# Altium project Channel One.PrjPcb
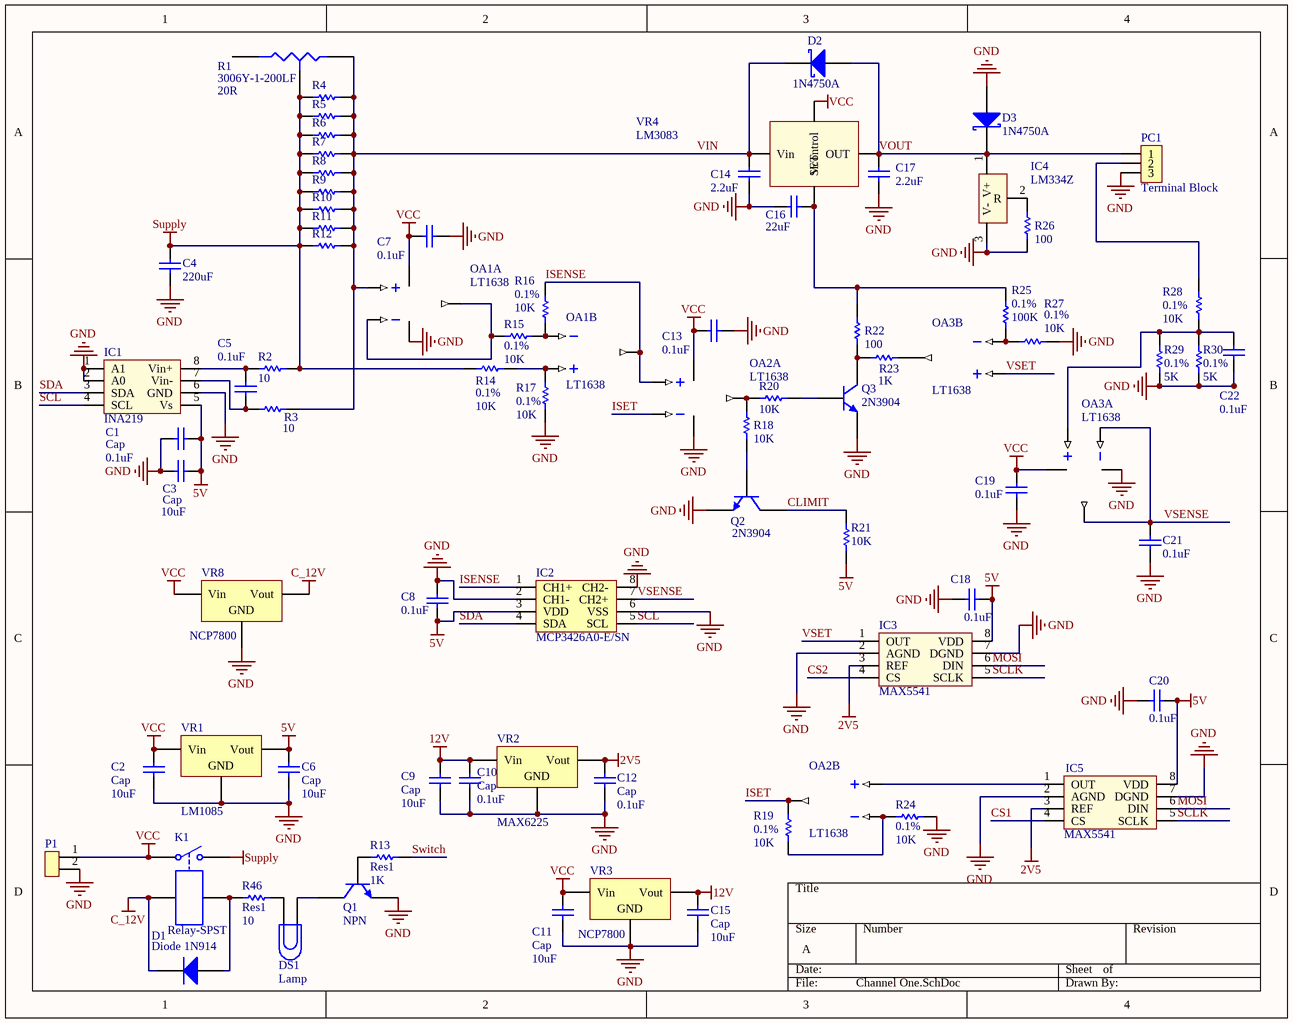
[diagram p0: Channel One.SchDoc]
3 sheets, 130 parts. Net scope: global (net labels, ports and power ports of the same name join across sheets).
Board file: Channel One.PcbDoc
Sheets:
  Channel One.SchDoc
  Logic.SchDoc
  Connector.SchDoc

## Sheet Channel One.SchDoc
size A

### Parts
C1  Cap  value 0.1uF  [RAD-0.1]
C2  Cap  value 10uF  [RAD-0.2]
C3  Cap  value 10uF  [RAD-0.2]
C4  value 220uF  [RAD-0.2]  (hidden comment: Cap)
C5  value 0.1uF  [RAD-0.1]  (hidden comment: Cap)
C6  Cap  value 10uF  [RAD-0.2]
C7  value 0.1uF  [RAD-0.1]  (hidden comment: Cap)
C8  value 0.1uF  [RAD-0.1]  (hidden comment: Cap)
C9  Cap  value 10uF  [RAD-0.2]
C10  Cap  value 0.1uF  [RAD-0.1]
C11  Cap  value 10uF  [RAD-0.2]
C12  Cap  value 0.1uF  [RAD-0.1]
C13  value 0.1uF  [RAD-0.1]  (hidden comment: Cap)
C14  value 2.2uF  [RAD-0.1]  (hidden comment: Cap)
C15  Cap  value 10uF  [RAD-0.2]
C16  value 22uF  [RAD-0.2]  (hidden comment: Cap)
C17  value 2.2uF  [RAD-0.2]  (hidden comment: Cap)
C18  value 0.1uF  [RAD-0.1]  (hidden comment: Cap)
C19  value 0.1uF  [RAD-0.1]  (hidden comment: Cap)
C20  value 0.1uF  [RAD-0.1]  (hidden comment: Cap)
C21  value 0.1uF  [RAD-0.1]  (hidden comment: Cap)
C22  value 0.1uF  [RAD-0.1]  (hidden comment: Cap)
D1  Diode 1N914  [DO-35]
D2  1N4750A  [DO-35]
D3  1N4750A  [DO-35]
DS1  Lamp  [PIN2]
IC1  INA219  [8-SO]
IC2  MCP3426A0-E/SN  [8-SO]
IC3  MAX5541  [8-SO]
IC4  LM334Z  [LM134]
IC5  MAX5541  [8-SO]
K1  Relay-SPST  [MODULE4]
OA1  LT1638  [8-DIP]  (parts A,B of 2)
OA2  LT1638  [8-DIP]  (parts A,B of 2)
OA3  LT1638  [8-DIP]  (parts A,B of 2)
P1  Power Connector  [Power Connector]  (value not drawn)
PC1  Terminal Block  [Terminal Block 3]
Q1  NPN  [TO-226-AA]
Q2  2N3904  [TO-226-AA]
Q3  2N3904  [TO-226-AA]
R1  3006Y-1-200LF  value 20R  [VR3]
R2  value 10  [AXIAL-0.3]  (hidden comment: Res1)
R3  value 10  [AXIAL-0.3]  (hidden comment: Res1)
R4  Shunt  [AXIAL-0.3]  (value not drawn)
R5  Shunt  [AXIAL-0.3]  (value not drawn)
R6  Shunt  [AXIAL-0.3]  (value not drawn)
R7  Shunt  [AXIAL-0.3]  (value not drawn)
R8  Shunt  [AXIAL-0.3]  (value not drawn)
R9  Shunt  [AXIAL-0.3]  (value not drawn)
R10  Shunt  [AXIAL-0.3]  (value not drawn)
R11  Shunt  [AXIAL-0.3]  (value not drawn)
R12  Shunt  [AXIAL-0.3]  (value not drawn)
R13  Res1  value 1K  [AXIAL-0.3]
R14  0.1%  value 10K  [AXIAL-0.3]
R15  0.1%  value 10K  [AXIAL-0.3]
R16  0.1%  value 10K  [AXIAL-0.3]
R17  0.1%  value 10K  [AXIAL-0.3]
R18  value 10K  [AXIAL-0.3]  (hidden comment: Res)
R19  0.1%  value 10K  [AXIAL-0.3]
R20  value 10K  [AXIAL-0.3]  (hidden comment: Res)
R21  value 10K  [AXIAL-0.3]  (hidden comment: Res1)
R22  value 100  [AXIAL-0.3]  (hidden comment: Res)
R23  value 1K  [AXIAL-0.3]  (hidden comment: Res)
R24  0.1%  value 10K  [AXIAL-0.3]
R25  0.1%  value 100K  [AXIAL-0.3]
R26  value 100  [AXIAL-0.3]  (hidden comment: Res)
R27  0.1%  value 10K  [AXIAL-0.3]
R28  0.1%  value 10K  [AXIAL-0.3]
R29  0.1%  value 5K  [AXIAL-0.3]
R30  0.1%  value 5K  [AXIAL-0.3]
R46  Res1  value 10  [AXIAL-0.3]
VR1  LM1085  [TO220]
VR2  MAX6225  [8-DIP]
VR3  NCP7800  [TO220]
VR4  LM3083  [LT3083]
VR8  NCP7800  [TO220]

### Nets
2V5: C12.2 IC3.3(REF) IC5.3(REF) VR2.6(Vout)
5V: C1.2 C3.2 C6.2 C8.1 C18.2 C20.2 IC1.5(Vs) IC2.3(VDD) IC3.8(VDD) IC5.8(VDD) R21.1 VR1.3(Vout)
12V: C9.2 C10.2 C15.2 VR2.2(Vin) VR3.3(Vout)
C_12V: D1.2(K) K1.3 VR8.3(Vout)
GND: C1.1 C2.1 C3.1 C4.1 C6.1 C7.2 C8.2 C9.1 C10.1 C11.1 C12.1 C13.2 C14.1 C15.1 C16.2 C17.1 C18.1 C19.1 C20.1 C21.2 C22.2 D3.1(A) IC1.1(A1) IC1.2(A0) IC1.6(GND) IC2.2(CH1-) IC2.6(VSS) IC2.8(CH2-) IC3.2(AGND) IC3.7(DGND) IC4.3(V-) IC5.2(AGND) IC5.7(DGND) OA1.4(V-) OA2.4(V-) OA3.4(V-) P1.2 PC1.3 Q1.3(E) Q2.3(E) Q3.3(E) R17.1 R24.2 R26.2 R27.2 R29.1 R30.1 VR1.2(GND) VR2.4(GND) VR3.2(GND) VR8.2(GND)
Supply: C4.2 K1.2 R1.3(TAP) R2.1 R4.1 R5.1 R6.1 R7.1 R8.1 R9.1 R10.1 R11.1 R12.1 R14.1
VCC: C2.2 C7.1 C11.2 C13.1 C19.2 K1.1 OA1.8(V+) OA2.8(V+) OA3.8(V+) P1.1 VR1.1(Vin) VR3.1(Vin) VR4.4(Vcontrol) VR8.1(Vin)
CLIMIT: Q2.1(C) R21.2
CS1: IC5.4(CS)
CS2: IC3.4(CS)
ISENSE: IC2.1(CH1+) OA1.7(OUTB) OA2.3(+INA) R16.2
ISET: OA2.2(-INA) OA2.7(OUTB) R19.1
MOSI: IC3.6(DIN) IC5.6(DIN)
SCL: IC1.4(SCL) IC2.5(SCL)
SCLK: IC3.5(SCLK) IC5.5(SCLK)
SDA: IC1.3(SDA) IC2.4(SDA)
Switch: R13.1
VIN: C14.2 D2.2(K) OA1.3(+INA) R1.1(A) R3.2 R4.2 R5.2 R6.2 R7.2 R8.2 R9.2 R10.2 R11.2 R12.2 VR4.5(Vin)
VOUT: C17.2 D2.1(A) D3.2(K) IC4.1(V+) PC1.1 VR4.3(OUT)
VSENSE: C21.1 IC2.7(CH2+) OA3.1(OUTA) OA3.2(-INA)
VSET: IC3.1(OUT) OA3.5(+INB)
NetC5_1: C5.1 IC1.7(Vin-) R3.1
NetC5_2: C5.2 IC1.8(Vin+) R2.2
NetC16_1: C16.1 R22.1 R25.1 VR4.2(SET)
NetC22_1: C22.1 OA3.3(+INA) R28.1 R29.2 R30.2
NetD1_1: D1.1(A) K1.4 R46.2
NetDS1_1: DS1.1 Q1.1(C)
NetDS1_2: DS1.2 R46.1
NetIC4_2: IC4.2(R) R26.1
NetIC5_1: IC5.1(OUT) OA2.5(+INB)
NetOA1_1: OA1.1(OUTA) OA1.2(-INA) R15.1
NetOA1_5: OA1.5(+INB) R14.2 R17.2
NetOA1_6: OA1.6(-INB) R15.2 R16.1
NetOA2_1: OA2.1(OUTA) R18.1 R20.2
NetOA2_6: OA2.6(-INB) R19.2 R24.1
NetOA3_6: OA3.6(-INB) R25.2 R27.1
NetOA3_7: OA3.7(OUTB) R23.2
NetPC1_2: PC1.2 R28.2
NetQ1_2: Q1.2(B) R13.2
NetQ2_2: Q2.2(B) R18.2
NetQ3_1: Q3.1(C) R22.2 R23.1
NetQ3_2: Q3.2(B) R20.1

Not connected (* = marked no-connect by the designer): R1 2(B)

### Library data of the parts
C1-C22 = Cap: Capacitor; Published: 8-Jun-2000; LatestRevisionDate: 17-Jul-2002; LatestRevisionNote: Re-released for DXP Platform.; PackageReference: RAD-0.3; Publisher: Altium Limited; PackageDescription: Radial Cap, Thru-Hole; 2 Leads; 0.3 in Pin Spacing
D1 = Diode 1N914: High Conductance Fast Diode; Published: 8-Jun-2000; LatestRevisionDate: 17-Jul-2002; LatestRevisionNote: Re-released for DXP Platform.; DatasheetVersion: 1997; PackageReference: DO-35; Publisher: Altium Limited; PackageDescription: Diode, Axial; Body 3.8 x 1.9 mm (LxDia. max), Lead Dia. 0.53 mm (max); Code_JEDEC: DO-204-AH; ComponentLink1Description: Manufacturer Link; ComponentLink1URL: http://www.fairchildsemi.com/; ComponentLink2Description: Datasheet; ComponentLink2URL: http://www.fairchildsemi.com/ds/1N%2F1N4448.pdf
D2 D3 = D Schottky: Schottky Diode; Published: 8-Jun-2000; LatestRevisionDate: 17-Jul-2002; LatestRevisionNote: Re-released for DXP Platform.; PackageReference: SMB; Publisher: Altium Limited; PackageDescription: DO-214-AA/SMB; 2 C-Bend Leads; Body 5.3 x 3.6 mm, inc. leads (LxW); Code_JEDEC: DO-214-AA
DS1 = Lamp: Incandescent Bulb; Published: 24-Mar-1999; LatestRevisionDate: 17-Jul-2002; LatestRevisionNote: Re-released for DXP Platform.; PackageReference: PIN2; Publisher: Altium Limited
IC1 = Current Sense
IC2 = ADC
IC3 IC5 = DAC
IC4 = Constant Current
K1 = Relay-SPST: Single-Pole Single-Throw Relay; Published: 24-Mar-1999; LatestRevisionDate: 17-Jul-2002; LatestRevisionNote: Re-released for DXP Platform.; PackageReference: MODULE4; Publisher: Altium Limited
OA1-OA3 = Operational Amp
Q1-Q3 = NPN: NPN Bipolar Transistor; Published: 8-Jun-2000; LatestRevisionDate: 17-Jul-2002; LatestRevisionNote: Re-released for DXP Platform.; PackageReference: TO-226-AA; Publisher: Altium Limited; PackageDescription: TO, Flat Index; 3 In-Line, Axial Leads; Body Dia. 4.8mm; Leads 0.55 x 0.51 mm (max); Code_JEDEC: TO-226-AA
R1 = Res Tap: Tapped Resistor; Sim Note: Enter the Resistance value and the set point into parameter fields.; Set Position: 0.5; Published: 24-Mar-1999; LatestRevisionDate: 17-Jul-2002; LatestRevisionNote: Re-released for DXP Platform.; PackageReference: VR3; Publisher: Altium Limited; PackageDescription: Variable Resistor, Thru-Hole; 3 Leads
R2 R3 R13-R30 R46 = Res1: Resistor; Published: 8-Jun-2000; LatestRevisionDate: 17-Jul-2002; LatestRevisionNote: Re-released for DXP Platform.; PackageReference: AXIAL-0.3; Publisher: Altium Limited; PackageDescription: Axial Device, Thru-Hole; 2 Leads; 0.3 in Pin Spacing
R4-R12 = Res1: Resistor; Value: 10; Published: 8-Jun-2000; LatestRevisionDate: 17-Jul-2002; LatestRevisionNote: Re-released for DXP Platform.; PackageReference: AXIAL-0.3; Publisher: Altium Limited; PackageDescription: Axial Device, Thru-Hole; 2 Leads; 0.3 in Pin Spacing
VR1 = Voltage Regulator 5V
VR2 = Voltage Reference 2.5V
VR3 VR8 = Voltage Regulator 12V
VR4 = Adjustable Regulator

## Sheet Logic.SchDoc
size A
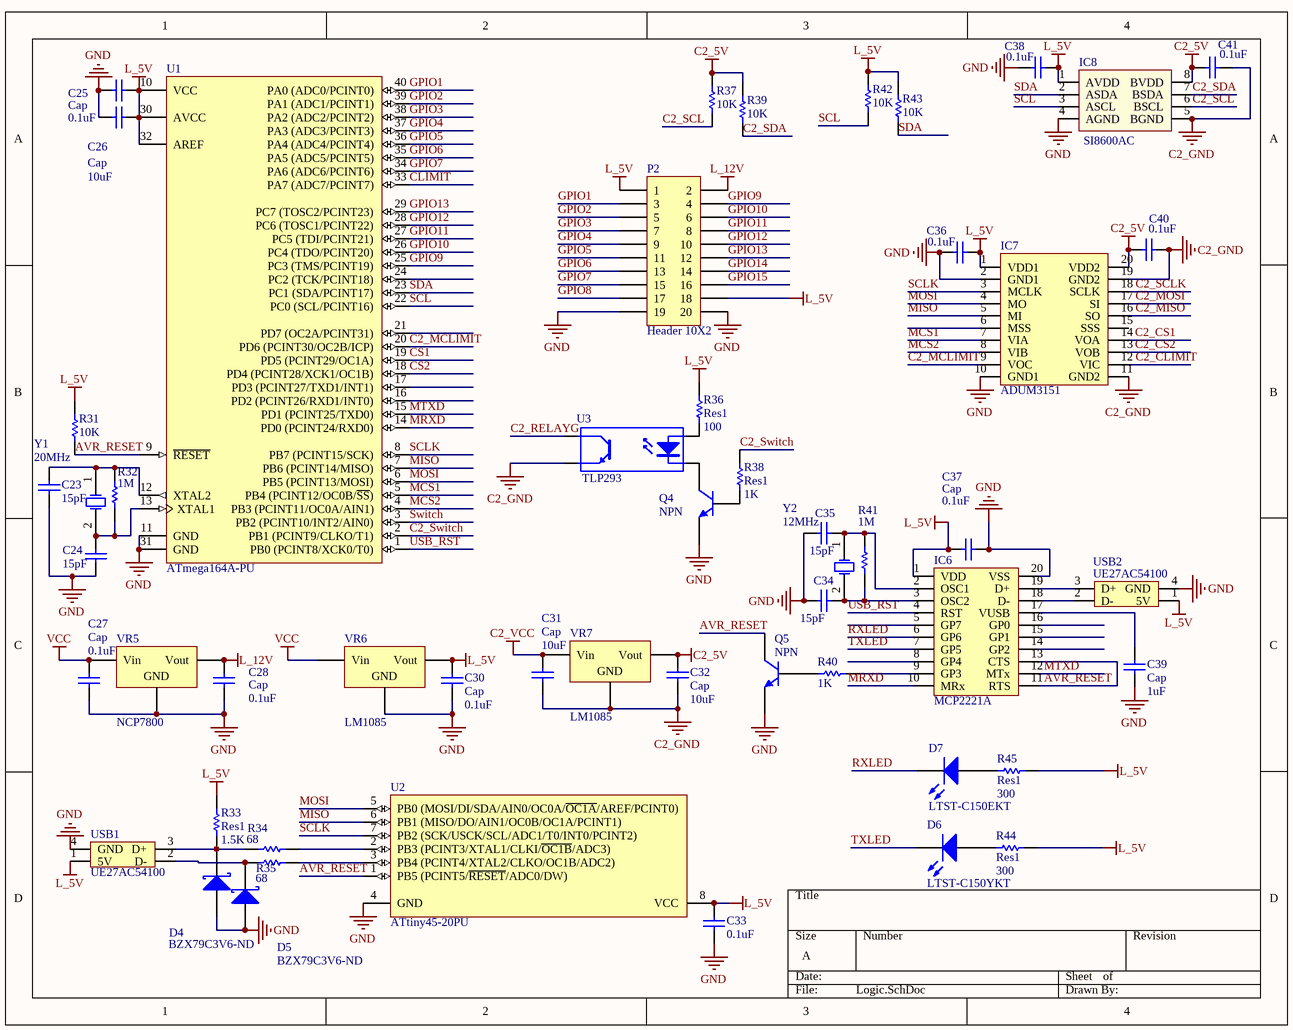
[diagram p1: Logic.SchDoc]

### Parts
C23  value 15pF  [RAD-0.1]  (hidden comment: Cap)
C24  value 15pF  [RAD-0.1]  (hidden comment: Cap)
C25  Cap  value 0.1uF  [RAD-0.1]
C26  Cap  value 10uF  [RAD-0.2]
C27  Cap  value 0.1uF  [RAD-0.1]
C28  Cap  value 0.1uF  [RAD-0.1]
C30  Cap  value 0.1uF  [RAD-0.1]
C31  Cap  value 10uF  [RAD-0.1]
C32  Cap  value 10uF  [RAD-0.1]
C33  value 0.1uF  [RAD-0.1]  (hidden comment: Cap)
C34  value 15pF  [RAD-0.1]  (hidden comment: Cap)
C35  value 15pF  [RAD-0.1]  (hidden comment: Cap)
C36  value 0.1uF  [RAD-0.1]  (hidden comment: Cap)
C37  Cap  value 0.1uF  [RAD-0.1]
C38  value 0.1uF  [RAD-0.1]  (hidden comment: Cap)
C39  Cap  value 1uF  [RAD-0.1]
C40  value 0.1uF  [RAD-0.1]  (hidden comment: Cap)
C41  value 0.1uF  [RAD-0.1]  (hidden comment: Cap)
D4  BZX79C3V6-ND  [DO-35]
D5  BZX79C3V6-ND  [DO-35]
D6  LTST-C150YKT  [3.2X1.6X1.1]
D7  LTST-C150EKT  [3.2X1.6X1.1]
IC6  MCP2221A  [20-SO]
IC7  ADUM3151  [20-SSOP]
IC8  SI8600AC  [8-SO]
P2  Header 10X2  [HDR2X10]
Q4  NPN  [TO-226-AA]
Q5  NPN  [TO-226-AA]
R31  value 10K  [AXIAL-0.3]  (hidden comment: Res1)
R32  value 1M  [AXIAL-0.3]  (hidden comment: Res1)
R33  Res1  value 1.5K  [AXIAL-0.3]
R34  value 68  [AXIAL-0.3]  (hidden comment: Res1)
R35  value 68  [AXIAL-0.3]  (hidden comment: Res1)
R36  Res1  value 100  [AXIAL-0.3]
R37  value 10K  [AXIAL-0.3]  (hidden comment: Res1)
R38  Res1  value 1K  [AXIAL-0.3]
R39  value 10K  [AXIAL-0.3]  (hidden comment: Res1)
R40  value 1K  [AXIAL-0.3]  (hidden comment: Res1)
R41  value 1M  [AXIAL-0.3]  (hidden comment: Res1)
R42  value 10K  [AXIAL-0.3]  (hidden comment: Res1)
R43  value 10K  [AXIAL-0.3]  (hidden comment: Res1)
R44  Res1  value 300  [AXIAL-0.3]
R45  Res1  value 300  [AXIAL-0.3]
U1  ATmega164A-PU  [40P6]
U2  ATtiny45-20PU  [8P3]
U3  TLP293  [2-SO]
USB1  UE27AC54100  [USB]
USB2  UE27AC54100  [USB]
VR5  NCP7800  [TO220]
VR6  LM1085  [TO220]
VR7  LM1085  [TO220]
Y1  20MHz  [R38]
Y2  12MHz  [R38]

### Nets
C2_5V: C32.2 C40.2 C41.1 IC7.20(VDD2) IC8.8(BVDD) R37.2 R39.2 VR7.3(Vout)
C2_GND: C31.1 C32.1 C40.1 C41.2 IC7.11(GND2) IC7.19(GND2) IC8.5(BGND) U3.3(E) VR7.2(GND)
C2_VCC: C31.2 VR7.1(Vin)
GND: C23.2 C24.2 C25.1 C26.1 C27.1 C28.1 C30.1 C33.1 C34.1 C35.1 C36.1 C37.2 C38.1 C39.1 D4.1(A) D5.1(A) IC6.20(VSS) IC7.2(GND1) IC7.10(GND1) IC8.4(AGND) P2.19 P2.20 Q4.3(E) Q5.3(E) U1.11(GND) U1.31(GND) U2.4(GND) USB1.4(GND) USB2.4(GND) VR5.2(GND) VR6.2(GND)
L_5V: C25.2 C26.2 C30.2 C33.2 C36.2 C37.1 C38.2 IC6.1(VDD) IC7.1(VDD1) IC8.1(AVDD) P2.1 P2.18 R31.2 R33.1 R36.2 R42.2 R43.2 R44.2 R45.2 U1.10(VCC) U1.30(AVCC) U1.32(AREF) U2.8(VCC) USB1.1(5V) USB2.1(5V) VR6.3(Vout)
L_12V: C28.2 P2.2 VR5.3(Vout)
VCC: C27.2 VR5.1(Vin) VR6.1(Vin)
AVR_RESET: IC6.11(RTS) IC6.13(CTS) Q5.1(C) R31.1 U1.9(~{RESET}) U2.1(PB5_(PCINT5/~{RESET}/ADC0/DW))
C2_CLIMIT: IC7.12(VIC)
C2_CS1: IC7.14(VOA)
C2_CS2: IC7.13(VOB)
C2_MCLIMIT: IC7.9(VOC) U1.20(PD6_(PCINT30/OC2B/ICP))
C2_MISO: IC7.16(SO)
C2_MOSI: IC7.17(SI)
C2_RELAYG: U3.4(C)
C2_SCL: IC8.6(BSCL) R37.1
C2_SCLK: IC7.18(SCLK)
C2_SDA: IC8.7(BSDA) R39.1
C2_Switch: R38.1 U1.2(PB1_(PCINT9/CLKO/T1))
CLIMIT: U1.33(PA7_(ADC7/PCINT7))
CS1: U1.19(PD5_(PCINT29/OC1A))
CS2: U1.18(PD4_(PCINT28/XCK1/OC1B))
GPIO1: P2.3 U1.40(PA0_(ADC0/PCINT0))
GPIO2: P2.5 U1.39(PA1_(ADC1/PCINT1))
GPIO3: P2.7 U1.38(PA2_(ADC2/PCINT2))
GPIO4: P2.9 U1.37(PA3_(ADC3/PCINT3))
GPIO5: P2.11 U1.36(PA4_(ADC4/PCINT4))
GPIO6: P2.13 U1.35(PA5_(ADC5/PCINT5))
GPIO7: P2.15 U1.34(PA6_(ADC6/PCINT6))
GPIO8: P2.17
GPIO9: P2.4 U1.25(PC3_(TMS/PCINT19))
GPIO10: P2.6 U1.26(PC4_(TDO/PCINT20))
GPIO11: P2.8 U1.27(PC5_(TDI/PCINT21))
GPIO12: P2.10 U1.28(PC6_(TOSC1/PCINT22))
GPIO13: P2.12 U1.29(PC7_(TOSC2/PCINT23))
GPIO14: P2.14
GPIO15: P2.16
MCS1: IC7.7(VIA) U1.5(PB4_(PCINT12/OC0B/~{SS}))
MCS2: IC7.8(VIB) U1.4(PB3_(PCINT11/OC0A/AIN1))
MISO: IC7.5(MI) U1.7(PB6_(PCINT14/MISO)) U2.6(PB1_(MISO/DO/AIN1/OC0B/OC1A/PCINT1))
MOSI: IC7.4(MO) U1.6(PB5_(PCINT13/MOSI)) U2.5(PB0_(MOSI/DI/SDA/AIN0/OC0A/~{OC1A}/AREF/PCINT0))
MRXD: IC6.10(MRx) U1.14(PD0_(PCINT24/RXD0))
MTXD: IC6.12(MTx) U1.15(PD1_(PCINT25/TXD0))
RXLED: D7.2(K) IC6.6(GP6)
SCL: IC8.3(ASCL) R42.1 U1.22(PC0_(SCL/PCINT16))
SCLK: IC7.3(MCLK) U1.8(PB7_(PCINT15/SCK)) U2.7(PB2_(SCK/USCK/SCL/ADC1/T0/INT0/PCINT2))
SDA: IC8.2(ASDA) R43.1 U1.23(PC1_(SDA/PCINT17))
Switch: U1.3(PB2_(PCINT10/INT2/AIN0))
TXLED: D6.2(K) IC6.7(GP5)
USB_RST: IC6.4(RST) U1.1(PB0_(PCINT8/XCK0/T0))
NetC23_1: C23.1 R32.1 U1.12(XTAL2) Y1.1(OSC1)
NetC24_1: C24.1 R32.2 U1.13(XTAL1) Y1.2(OSC2)
NetC34_2: C34.2 IC6.3(OSC2) R41.2 Y2.2(OSC2)
NetC35_2: C35.2 IC6.2(OSC1) R41.1 Y2.1(OSC1)
NetC39_2: C39.2 IC6.17(VUSB)
NetD4_2: D4.2(K) R33.2 R34.2 USB1.3(D+)
NetD5_2: D5.2(K) R35.2 USB1.2(D-)
NetD6_1: D6.1(A) R44.1
NetD7_1: D7.1(A) R45.1
NetIC6_9: IC6.9(GP3) R40.2
NetIC6_18: IC6.18(D-) USB2.2(D-)
NetIC6_19: IC6.19(D+) USB2.3(D+)
NetQ4_1: Q4.1(C) U3.2(K)
NetQ4_2: Q4.2(B) R38.2
NetQ5_2: Q5.2(B) R40.1
NetR34_1: R34.1 U2.2(PB3_(PCINT3/XTAL1/CLKI/~{OC1B}/ADC3))
NetR35_1: R35.1 U2.3(PB4_(PCINT4/XTAL2/CLKO/OC1B/ADC2))
NetR36_1: R36.1 U3.1(A)

Not connected (* = marked no-connect by the designer): IC6 5(GP7) 8(GP4) 14(GP2) 15(GP1) 16(GP0); IC7 6(MSS) 15(SSS); U1 16(PD2_(PCINT26/RXD1/INT0)) 17(PD3_(PCINT27/TXD1/INT1)) 21(PD7_(OC2A/PCINT31)) 24(PC2_(TCK/PCINT18))

### Library data of the parts
C23-C28 C30-C41 = Cap: Capacitor; Published: 8-Jun-2000; LatestRevisionDate: 17-Jul-2002; LatestRevisionNote: Re-released for DXP Platform.; PackageReference: RAD-0.3; Publisher: Altium Limited; PackageDescription: Radial Cap, Thru-Hole; 2 Leads; 0.3 in Pin Spacing
D4 D5 = D Schottky: Schottky Diode; Published: 8-Jun-2000; LatestRevisionDate: 17-Jul-2002; LatestRevisionNote: Re-released for DXP Platform.; PackageReference: SMB; Publisher: Altium Limited; PackageDescription: DO-214-AA/SMB; 2 C-Bend Leads; Body 5.3 x 3.6 mm, inc. leads (LxW); Code_JEDEC: DO-214-AA
D6 D7 = LED2: Typical RED, GREEN, YELLOW, AMBER GaAs LED; Published: 8-Jun-2000; LatestRevisionDate: 17-Jul-2002; LatestRevisionNote: Re-released for DXP Platform.; PackageVersion: Feb-2002; PackageReference: 3.2X1.6X1.1; Publisher: Altium Limited; PackageDescription: SM LED; 2 Flat Leads
IC6 = USB To UART
IC7 = SPI Isolator
IC8 = I2C Isolator
P2 = Header 10X2: Header, 10-Pin, Dual row; LatestRevisionDate: 17-Jul-2002; LatestRevisionNote: Re-released for DXP Platform.; Publisher: Altium Limited
Q4 Q5 = NPN: NPN Bipolar Transistor; Published: 8-Jun-2000; LatestRevisionDate: 17-Jul-2002; LatestRevisionNote: Re-released for DXP Platform.; PackageReference: TO-226-AA; Publisher: Altium Limited; PackageDescription: TO, Flat Index; 3 In-Line, Axial Leads; Body Dia. 4.8mm; Leads 0.55 x 0.51 mm (max); Code_JEDEC: TO-226-AA
R31-R45 = Res1: Resistor; Published: 8-Jun-2000; LatestRevisionDate: 17-Jul-2002; LatestRevisionNote: Re-released for DXP Platform.; PackageReference: AXIAL-0.3; Publisher: Altium Limited; PackageDescription: Axial Device, Thru-Hole; 2 Leads; 0.3 in Pin Spacing
U1 = ATmega164A-PU: 8-bit AVR Microcontroller, 16KB Flash, 512 Bytes EEPROM, 1KB SRAM, 40-pin PDIP, Industrial Grade (-40°C to 85°C); Published: 1-Apr-2010; DatasheetVersion: revA, Jan-2010; PackageVersion: revB, Sep-2001; PackageReference: 40P6; Publisher: Altium Limited; PackageDescription: 40-lead (0.600"/15.24mm Wide) Plastic Dual Inline Package (PDIP); Supplier 1: Digi-Key; Supplier Part Number 1: ATMEGA164A-PU-ND; Supplier 2: Mouser; Supplier Part Number 2: 556-ATMEGA164A-PU; Code_JEDEC: MS-011-AC; ComponentLink1Description: Manufacturer Link; ComponentLink1URL: http://www.atmel.com/products/avr/default.asp?; ComponentLink2Description: ATmega164A/164PA/324A/324PA/644A/644PA/1284/1284P Datasheet; ComponentLink2URL: http://www.atmel.com/dyn/resources/prod_documents/doc8272.pdf; ComponentLink3Description: ATmega164A/164PA/324A/324PA/644A/644PA/1284/1284P Summary; ComponentLink3URL: http://www.atmel.com/dyn/resources/prod_documents/8272S.pdf; ComponentLink4Description: Atmel.com Home; ComponentLink4URL: http://www.atmel.com
U2 = ATtiny45-20PU: Low Power tinyAVR® 8-Bit Microcontroller, 4K Flash Memory, 20MHz, Industrial Temperature, 8-Lead PDIP, Pb-Free; Published: 20-Nov-2009; DatasheetVersion: DOC2586I, May-2008; PackageVersion: revB, Jan-2002; PackageReference: 8P3; Publisher: Altium Limited; PackageDescription: 8-Lead, 0.300" Wide Body, Plastic Dual In-Line Package (PDIP); Supplier 1: Digi-Key; Supplier Part Number 1: ATTINY45-20PU-ND; Supplier 2: Farnell; Supplier Part Number 2: 1288352; Supplier 3: Mouser; Supplier Part Number 3: 556-ATTINY45-20PU; Code_JEDEC: MS-001-BA; ComponentLink1Description: Manufacturer Link; ComponentLink1URL: http://www.atmel.com/products/AVR/tinyavr.asp?; ComponentLink2Description: Datasheet; ComponentLink2URL: http://www.atmel.com/dyn/resources/prod_documents/doc2586.pdf; ComponentLink3Description: Atmel.com Home; ComponentLink3URL: http://www.atmel.com
U3 = Optoisolator1: 4-Pin Phototransistor Optocoupler; Published: 24-Mar-1999; LatestRevisionDate: 04-Mar-2005; LatestRevisionNote: Sch pins 3 & 4 Swapped.; DatasheetVersion: Nov-2003; PackageReference: DIP-4; Publisher: Altium Limited
USB1 USB2 = USB
VR5 = Voltage Regulator 12V
VR6 VR7 = Voltage Regulator 5V
Y1 Y2 = XTAL: Crystal Oscillator; Published: 8-Jun-2000; LatestRevisionDate: 17-Jul-2002; LatestRevisionNote: Re-released for DXP Platform.; PackageReference: R38; Publisher: Altium Limited; PackageDescription: Crystal, Thru-Hole; 2 Leads; Body 3.1 x 8.2 mm (Dia.xH)

## Sheet Connector.SchDoc
size A
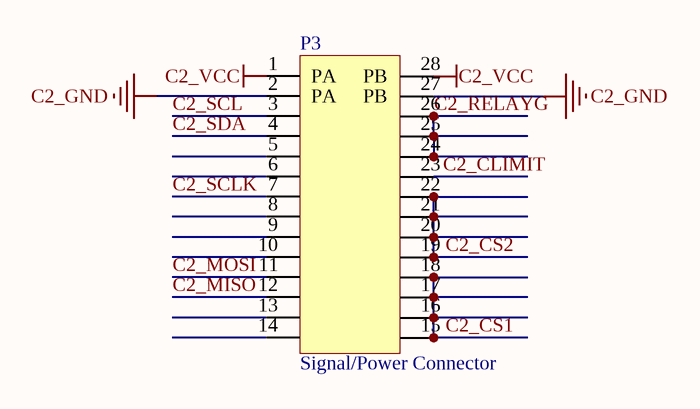
[diagram p2: Connector.SchDoc]

### Parts
P3  Signal/Power Connector  [Signal/Power Connector]

### Nets
C2_GND: P3.2(PA) P3.27(PB)
C2_VCC: P3.1(PA) P3.28(PB)
C2_CLIMIT: P3.23
C2_CS1: P3.15 P3.16 P3.17 P3.18
C2_CS2: P3.19 P3.20 P3.21 P3.22
C2_MISO: P3.12
C2_MOSI: P3.11
C2_RELAYG: P3.24 P3.25 P3.26
C2_SCL: P3.3
C2_SCLK: P3.7
C2_SDA: P3.4

Not connected (* = marked no-connect by the designer): P3 5 6 8 9 10 13 14

## Nets that join several sheets
C2_GND: Logic (9 pins), Connector (P3.2 P3.27)
C2_VCC: Logic (C31.2 VR7.1), Connector (P3.1 P3.28)
GND: Channel One (51 pins), Logic (31 pins)
VCC: Channel One (14 pins), Logic (C27.2 VR5.1 VR6.1)
C2_CLIMIT: Logic (IC7.12), Connector (P3.23)
C2_CS1: Logic (IC7.14), Connector (P3.15 P3.16 P3.17 P3.18)
C2_CS2: Logic (IC7.13), Connector (P3.19 P3.20 P3.21 P3.22)
C2_MISO: Logic (IC7.16), Connector (P3.12)
C2_MOSI: Logic (IC7.17), Connector (P3.11)
C2_RELAYG: Logic (U3.4), Connector (P3.24 P3.25 P3.26)
C2_SCL: Logic (IC8.6 R37.1), Connector (P3.3)
C2_SCLK: Logic (IC7.18), Connector (P3.7)
C2_SDA: Logic (IC8.7 R39.1), Connector (P3.4)
CLIMIT: Channel One (Q2.1 R21.2), Logic (U1.33)
CS1: Channel One (IC5.4), Logic (U1.19)
CS2: Channel One (IC3.4), Logic (U1.18)
MOSI: Channel One (IC3.6 IC5.6), Logic (IC7.4 U1.6 U2.5)
SCL: Channel One (IC1.4 IC2.5), Logic (IC8.3 R42.1 U1.22)
SCLK: Channel One (IC3.5 IC5.5), Logic (IC7.3 U1.8 U2.7)
SDA: Channel One (IC1.3 IC2.4), Logic (IC8.2 R43.1 U1.23)
Switch: Channel One (R13.1), Logic (U1.3)